# Altium schematic sheet Wireless_Lora.SchDoc
size 149 x 59 mm; SheetNumber: 4; SheetTotal: 5
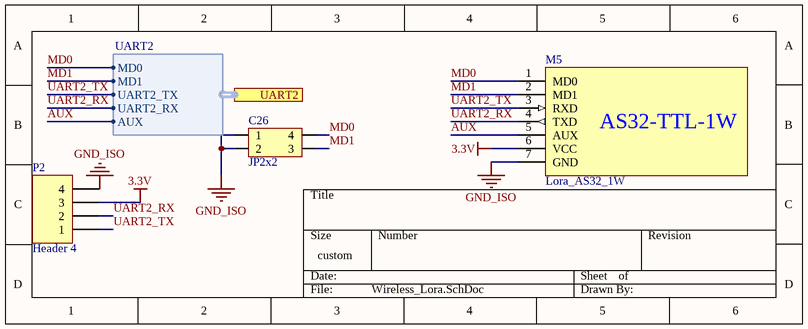
[diagram p0: Wireless_Lora.SchDoc]

## Parts
C26  JP2x2  [JP2-D2T]
M5  Lora_AS32_1W  [LORA_AS32-TTL-1W]
P2  Header 4  [HDR1X4]

## Ports
UART2 (harness UART2)

## Harnesses
UART2: MD0, MD1, UART2_TX, UART2_RX, AUX

## Nets
3.3V: M5.6(VCC) P2.3
GND_ISO: C26.1 C26.2 M5.7(GND) P2.4
AUX: M5.5(AUX) ; port UART2.AUX
MD0: C26.4 M5.1(MD0) ; port UART2.MD0
MD1: C26.3 M5.2(MD1) ; port UART2.MD1
UART2_RX: M5.4(TXD) P2.2 ; port UART2.UART2_RX
UART2_TX: M5.3(RXD) P2.1 ; port UART2.UART2_TX

## Notes on the sheet
- Title
- Size:
- Date:
- A3
- Number:
- Time:
- Revision:
- Sheet
- of
- NICHIETSUVN.COM <http://NICHIETSUVN.COM>
- R&D
- File:
- (in symbol Lora_AS32_1W) AS32-TTL-1W

## Library data of the parts
C26 = JP2x2: WR-PHD 2.54 mm Dual Socket Header; Manufacturer: W¨¹rth Elektronik eiSos GmbH; partNo: 61300421821; ComponentLink1 Description: Manufacturer; ComponentLink2 Description: Datasheet; NoPins: 04; Created Date: 29 March 2013; ComponentLink1URL: http://www.we-online.com; ComponentLink2URL: http://katalog.we-online.de/em/datasheet/6130xx21821.pdf; Created by: Karrer Zheng
P2 = Header 4: Header, 4-Pin; LatestRevisionDate: 17-Jul-2002; LatestRevisionNote: Re-released for DXP Platform.; Publisher: Altium Limited